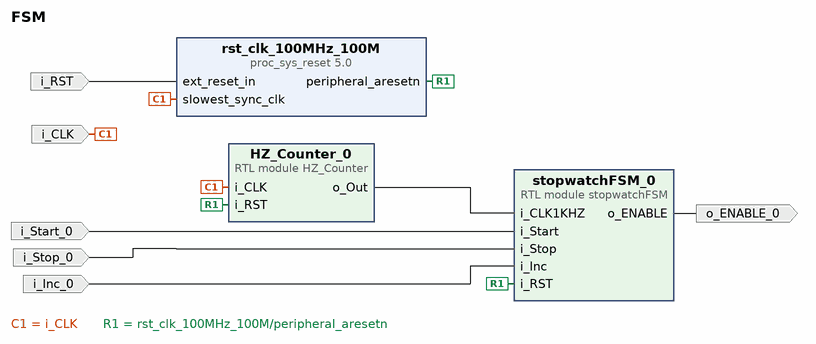
[diagram p0: block diagram of the top level]
# Vivado block design FSM, xc7z007sclg400-1, Vivado 2018.2
create_bd_design FSM

create_bd_port -dir I -type clk i_CLK
set_property -dict {CONFIG.FREQ_HZ 100000000} [get_bd_ports i_CLK]
create_bd_port -dir I -type rst i_RST
set_property -dict {CONFIG.POLARITY ACTIVE_LOW} [get_bd_ports i_RST]
create_bd_port -dir I i_Start_0
create_bd_port -dir I i_Stop_0
create_bd_port -dir O o_ENABLE_0
create_bd_port -dir I i_Inc_0

create_bd_cell -type module -reference HZ_Counter HZ_Counter_0
set_property -dict {CONFIG.c_NUM 500000} [get_bd_cells HZ_Counter_0]
create_bd_cell -type ip -vlnv xilinx.com:ip:proc_sys_reset:5.0 rst_clk_100MHz_100M
create_bd_cell -type module -reference stopwatchFSM stopwatchFSM_0

# ---- connections ----

connect_bd_net [get_bd_pins HZ_Counter_0/o_Out] [get_bd_pins stopwatchFSM_0/i_CLK1KHZ]
connect_bd_net -net clk_100MHz_1 [get_bd_ports i_CLK] [get_bd_pins HZ_Counter_0/i_CLK] [get_bd_pins rst_clk_100MHz_100M/slowest_sync_clk]
connect_bd_net [get_bd_pins rst_clk_100MHz_100M/peripheral_aresetn] [get_bd_pins HZ_Counter_0/i_RST] [get_bd_pins stopwatchFSM_0/i_RST]
connect_bd_net -net reset_rtl_0_1 [get_bd_ports i_RST] [get_bd_pins rst_clk_100MHz_100M/ext_reset_in]
connect_bd_net -net i_Start_0_1 [get_bd_ports i_Start_0] [get_bd_pins stopwatchFSM_0/i_Start]
connect_bd_net -net i_Stop_0_1 [get_bd_ports i_Stop_0] [get_bd_pins stopwatchFSM_0/i_Stop]
connect_bd_net [get_bd_pins stopwatchFSM_0/o_ENABLE] [get_bd_ports o_ENABLE_0]
connect_bd_net -net i_Inc_0_1 [get_bd_ports i_Inc_0] [get_bd_pins stopwatchFSM_0/i_Inc]

validate_bd_design
save_bd_design
